# EAGLE design MG (EAGLE 9.2.0)

## Sheet 1 of 3
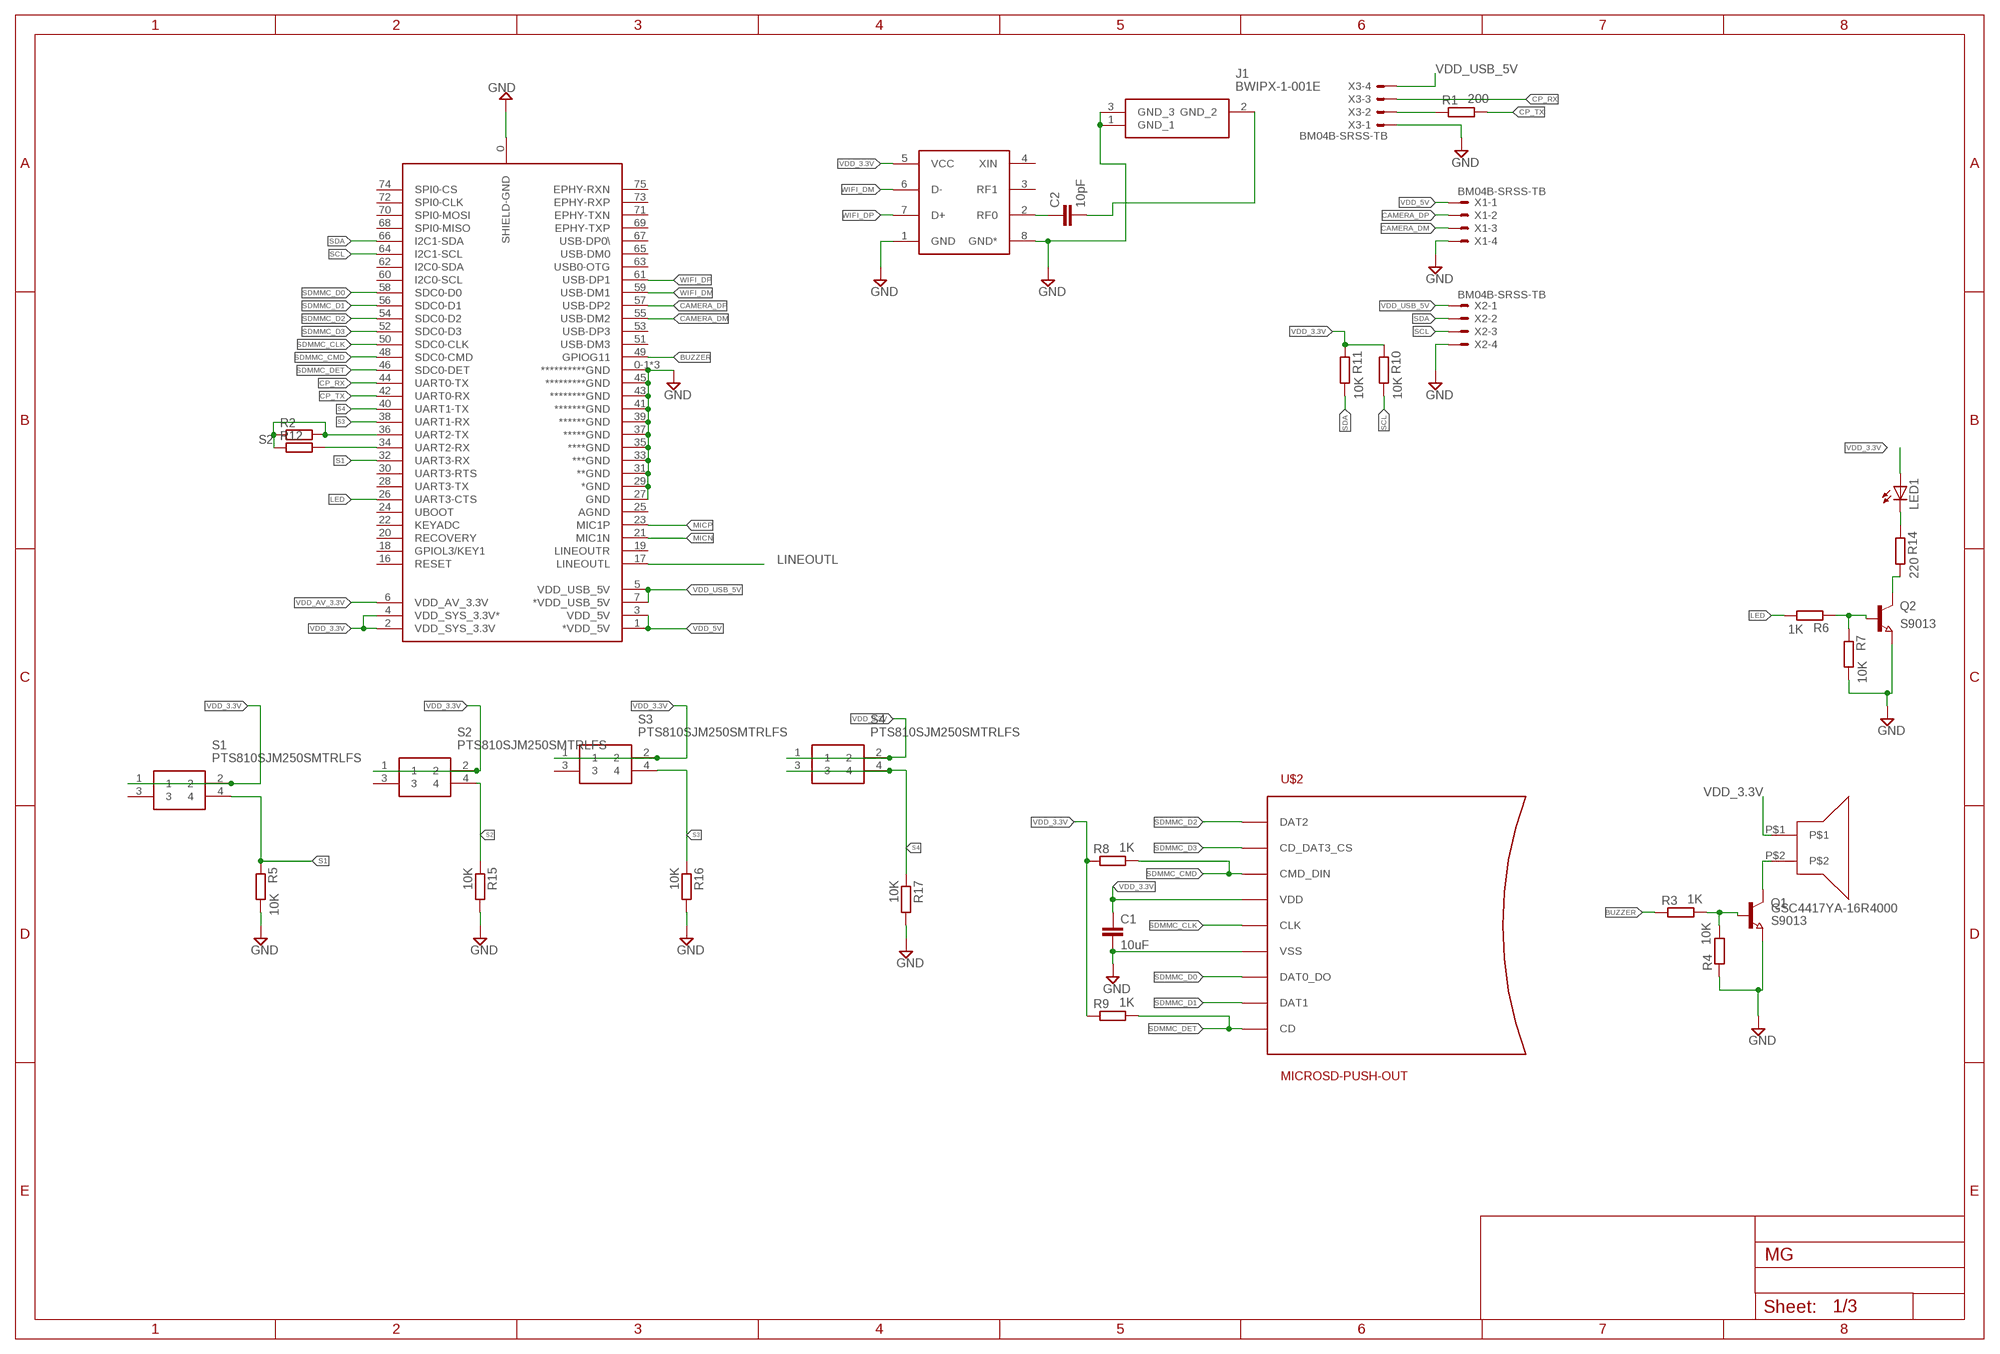
[diagram p0: schematic, sheet 1]

### Parts
C1  10uF  C-EUC0603  [C0603]
C2  10pF  C-EUC0603  [C0603]
J1  BWIPX-1-001E  [BWIPX1001E]
LED1  LEDSML0603  [SML0603]
Q1  S9013  NPN-TRANSISTOR_SOT23  [SOT23]
Q2  S9013  NPN-TRANSISTOR_SOT23  [SOT23]
R1  200  R-EU_R0603  [R0603]
R2  R-EU_R0201  [R0201]
R3  1K  R-EU_R0603  [R0603]
R4  10K  R-EU_R0603  [R0603]
R5  10K  R-EU_R0603  [R0603]
R6  1K  R-EU_R0603  [R0603]
R7  10K  R-EU_R0603  [R0603]
R8  1K  R-EU_R0603  [R0603]
R9  1K  R-EU_R0603  [R0603]
R10  10K  R-EU_R0603  [R0603]
R11  10K  R-EU_R0603  [R0603]
R12  R-EU_R0201  [R0201]
R14  220  R-EU_R0603  [R0603]
R15  10K  R-EU_R0603  [R0603]
R16  10K  R-EU_R0603  [R0603]
R17  10K  R-EU_R0603  [R0603]
S1  PTS810SJM250SMTRLFS  [PTS810SJG250SMTRLFS]
S2  PTS810SJM250SMTRLFS  [PTS810SJG250SMTRLFS]
S3  PTS810SJM250SMTRLFS  [PTS810SJG250SMTRLFS]
S4  PTS810SJM250SMTRLFS  [PTS810SJG250SMTRLFS]
U$1  QUANTUM-CORE  [QUANTUM-QUARK-N]
U$2  MICROSD-PUSH-OUT  [MICROSD-PUSH-OUT]
U$3  WIFI-BT-RTL8723BU  [USB-WIFI-BT-RTL8723BU]
U$4  GSC4417YA-16R4000  [GSC4417YA-16R4000]
X1  BM04B-SRSS-TB  [BM04B-SRSS-TB]
X2  BM04B-SRSS-TB  [BM04B-SRSS-TB]
X3  BM04B-SRSS-TB  [BM04B-SRSS-TB]

### Nets
BUZZER: R3.1 U$1.49(GPIOG11)
CAMERA_DM: U$1.55(USB-DM2) X1.3
CAMERA_DP: U$1.57(USB-DP2) X1.2
CP_RX: U$1.44(UART0-TX) X3.3
CP_TX: R1.2 U$1.42(UART0-RX)
GND: C1.2 J1.1(GND_1) J1.3(GND_3) Q1.2(E) Q2.2(E) R4.1 R5.2 R7.2 R15.2 R16.2 R17.2 U$1.0(SHIELD-GND) U$1.0-1(**********GND) U$1.0-2(**********GND) U$1.27(GND) U$1.29(*GND) U$1.31(**GND) U$1.33(***GND) U$1.35(****GND) U$1.37(*****GND) U$1.39(******GND) U$1.41(*******GND) U$1.43(********GND) U$1.45(*********GND) U$1.47(**********GND) U$2.6(VSS) U$2.G1(VSS) U$2.G2(VSS) U$2.G3(VSS) U$2.G4(VSS) U$3.1(GND) U$3.8(GND*) X1.4 X2.4 X3.1 ; also sheet 2
LED: R6.2 U$1.26(UART3-CTS)
LINEOUTL: U$1.17(LINEOUTL) ; also sheet 2
MICN: U$1.21(MIC1N)
MICP: U$1.23(MIC1P)
N$1: R1.1 X3.2
N$3: Q1.3(C) U$4.P$2
N$4: Q1.1(B) R3.2 R4.2
N$6: R12.2 U$1.34(UART2-RX)
N$9: C2.2 J1.2(GND_2)
N$10: Q2.3(C) R14.2
N$11: C2.1 U$3.2(RF0)
N$13: LED1.C R14.1
N$15: Q2.1(B) R6.1 R7.1
S1: R5.1 S1.4 U$1.32(UART3-RX)
S2: R2.1 R2.2 R12.1 R15.1 S2.4 U$1.36(UART2-TX)
S3: R16.1 S3.4 U$1.38(UART1-RX)
S4: R17.1 S4.3 S4.4 U$1.40(UART1-TX)
SCL: R10.2 U$1.64(I2C1-SCL) X2.3
SDA: R11.2 U$1.66(I2C1-SDA) X2.2
SDMMC_CLK: U$1.50(SDC0-CLK) U$2.5(CLK)
SDMMC_CMD: R8.2 U$1.48(SDC0-CMD) U$2.3(CMD_DIN)
SDMMC_D0: U$1.58(SDC0-D0) U$2.7(DAT0_DO)
SDMMC_D1: U$1.56(SDC0-D1) U$2.8(DAT1)
SDMMC_D2: U$1.54(SDC0-D2) U$2.1(DAT2)
SDMMC_D3: U$1.52(SDC0-D3) U$2.2(CD_DAT3_CS)
SDMMC_DET: R9.2 U$1.46(SDC0-DET) U$2.CD
VDD_3.3V: C1.1 LED1.A R8.1 R9.1 R10.1 R11.1 S1.1 S1.2 S2.1 S2.2 S3.1 S3.2 S4.1 S4.2 U$1.2(VDD_SYS_3.3V) U$1.4(VDD_SYS_3.3V*) U$2.4(VDD) U$3.5(VCC) U$4.P$1
VDD_5V: U$1.1(*VDD_5V) U$1.3(VDD_5V) X1.1 ; also sheet 2
VDD_AV_3.3V: U$1.6(VDD_AV_3.3V)
VDD_USB_5V: U$1.5(VDD_USB_5V) U$1.7(*VDD_USB_5V) X2.1 X3.4
WIFI_DM: U$1.59(USB-DM1) U$3.6(D-)
WIFI_DP: U$1.61(USB-DP1) U$3.7(D+)
Unconnected: S1.3 S2.3 S3.3 U$1.16(RESET) U$1.18(GPIOL3/KEY1) U$1.19(LINEOUTR) U$1.20(RECOVERY) U$1.22(KEYADC) U$1.24(UBOOT) U$1.25(AGND) U$1.28(UART3-TX) U$1.30(UART3-RTS) U$1.51(USB-DM3) U$1.53(USB-DP3) U$1.60(I2C0-SCL) U$1.62(I2C0-SDA) U$1.63(USB0-OTG) U$1.65(USB-DM0) U$1.67(USB-DP0\) U$1.68(SPI0-MISO) U$1.69(EPHY-TXP) U$1.70(SPI0-MOSI) U$1.71(EPHY-TXN) U$1.72(SPI0-CLK) U$1.73(EPHY-RXP) U$1.74(SPI0-CS) U$1.75(EPHY-RXN) U$3.3(RF1) U$3.4(XIN)

## Sheet 2 of 3
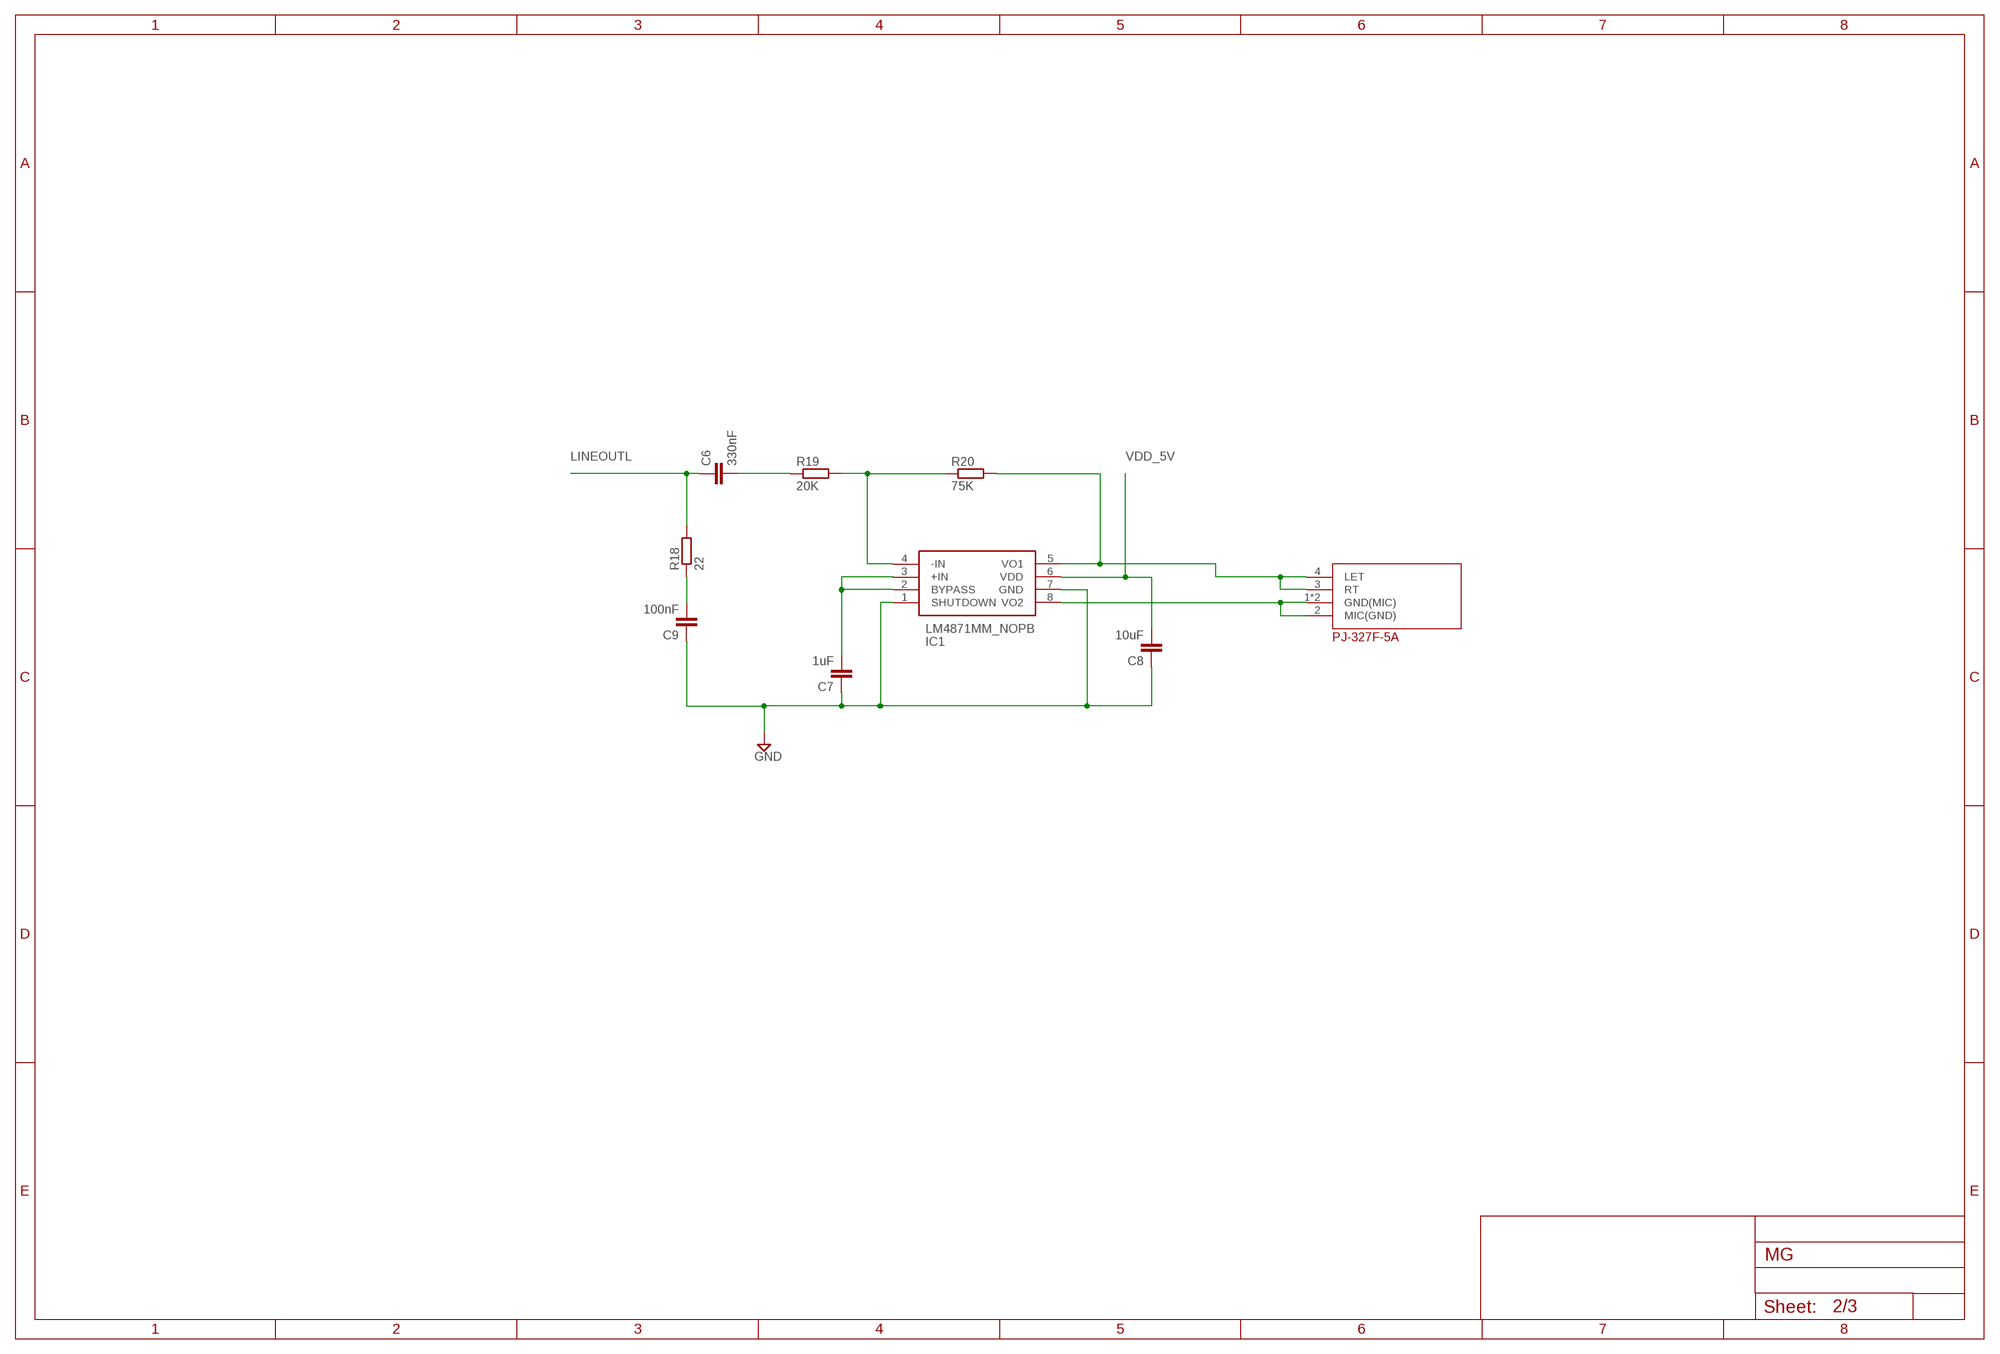
[diagram p1: schematic, sheet 2]

### Parts
C6  330nF  C-EUC0603  [C0603]
C7  1uF  C-EUC0603  [C0603]
C8  10uF  C-EUC0603  [C0603]
C9  100nF  C-EUC0603  [C0603]
IC1  LM4871MM_NOPB  [SOP65P490X110-8N]
R18  22  R-EU_R0603  [R0603]
R19  20K  R-EU_R0603  [R0603]
R20  75K  R-EU_R0603  [R0603]
U$7  PJ-327F-5A  [PJ-327F-5A]

### Nets
GND: C7.1 C8.1 C9.1 IC1.1(SHUTDOWN) IC1.7(GND) ; also sheet 1
LINEOUTL: C6.1 R18.2 ; also sheet 1
N$7: IC1.8(VO2) U$7.1(GND(MIC)) U$7.2(MIC(GND)) U$7.5(GND(MIC))
N$14: C7.2 IC1.2(BYPASS) IC1.3(+IN)
N$16: IC1.4(-IN) R19.2 R20.1
N$17: C6.2 R19.1
N$18: C9.2 R18.1
N$21: IC1.5(VO1) R20.2 U$7.3(RT) U$7.4(LET)
VDD_5V: C8.2 IC1.6(VDD) ; also sheet 1

## Sheet 3 of 3
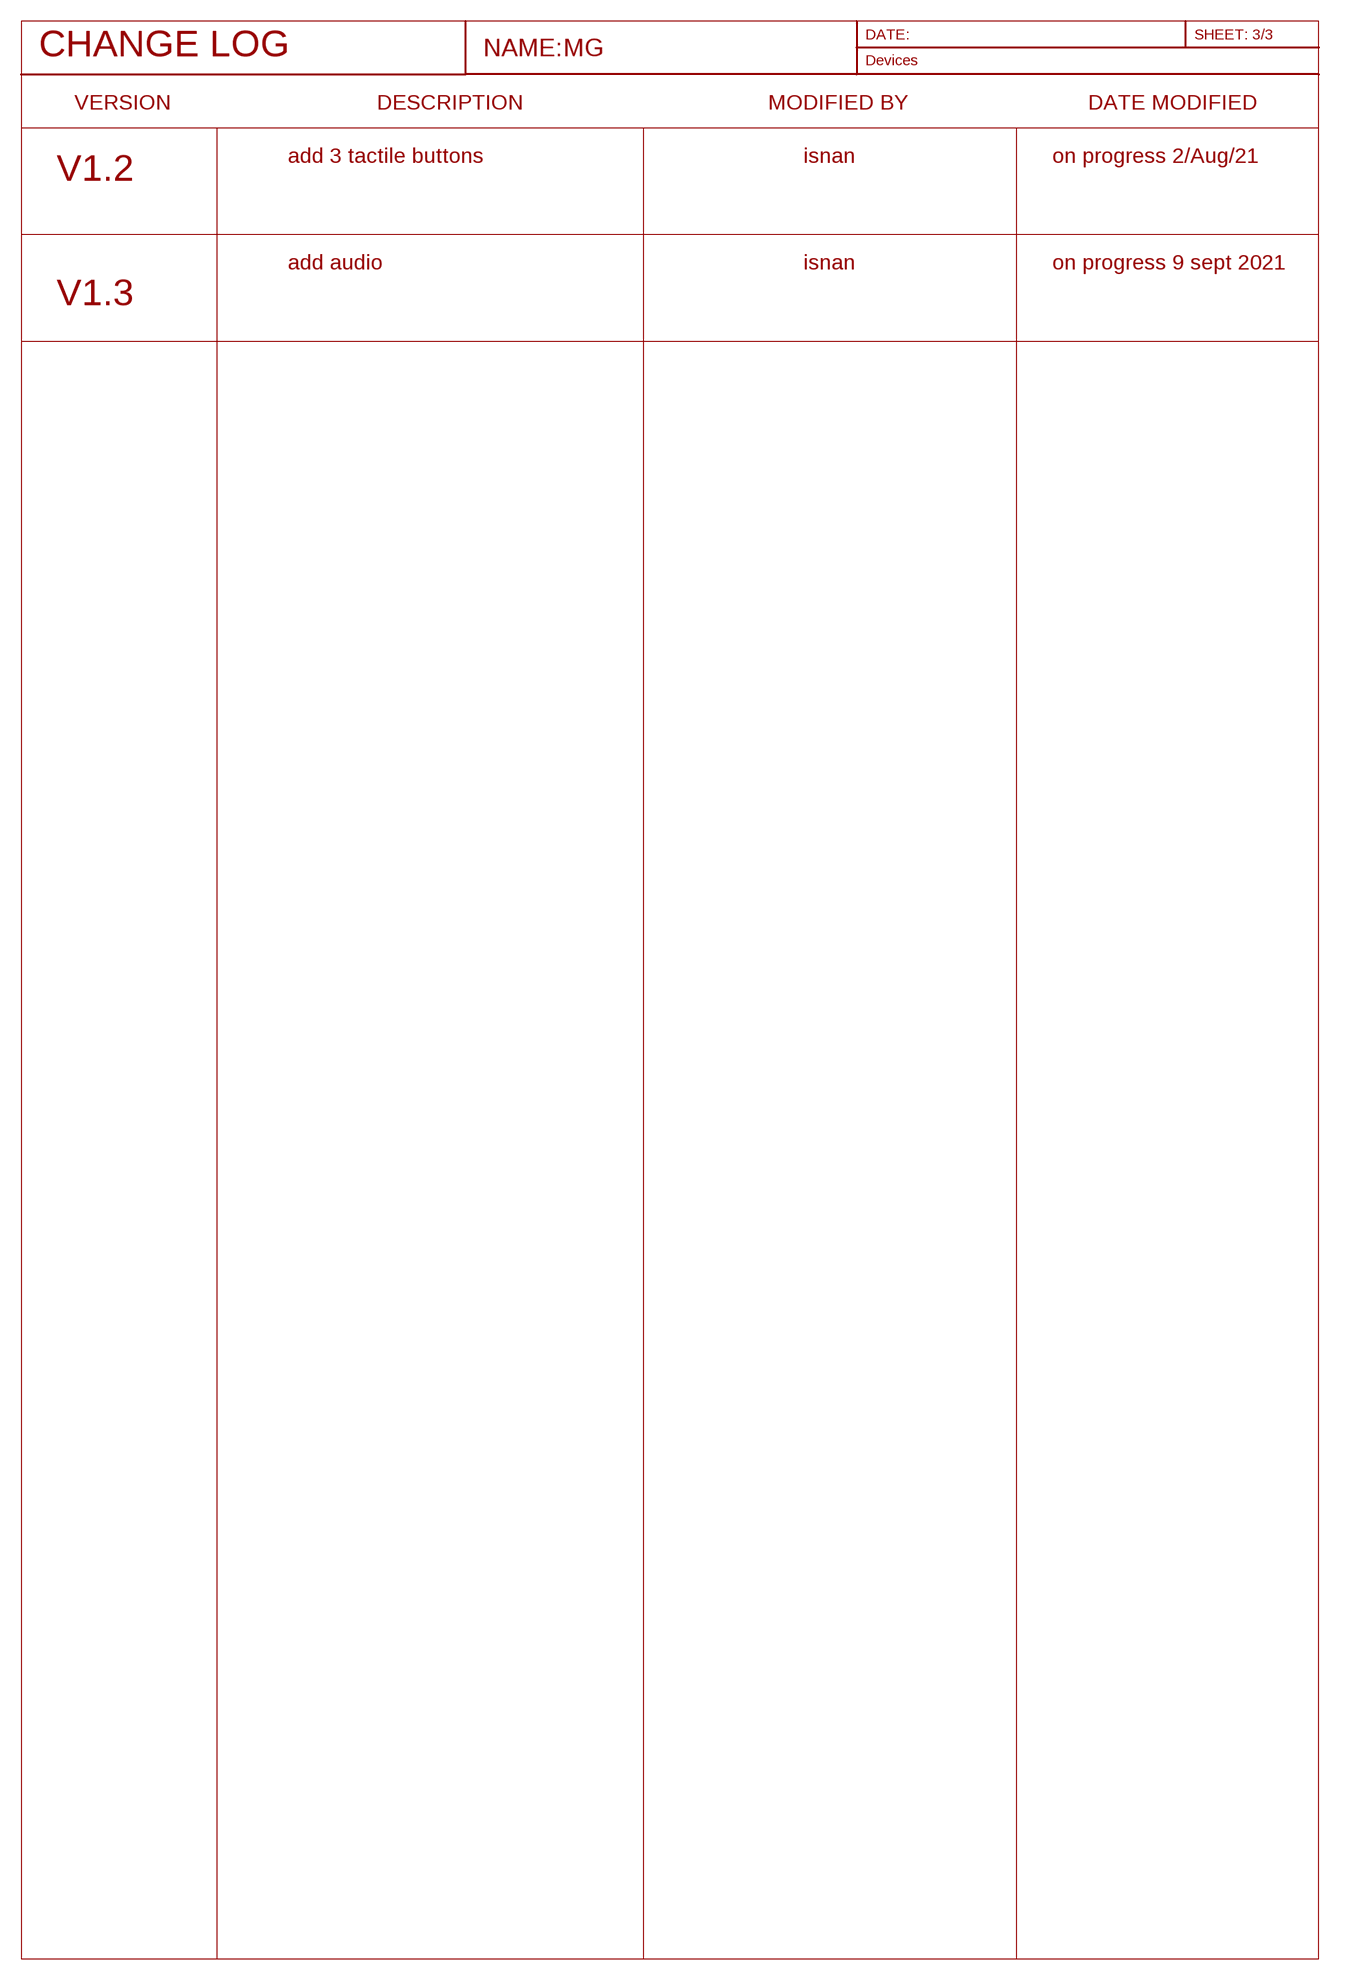
[diagram p2: schematic, sheet 3]

### Notes on the sheet
- CHANGE LOG
- VERSION | DESCRIPTION | MODIFIED BY | DATE MODIFIED
- add 3 tactile buttons | isnan | on progress 2/Aug/21
- V1.2
- add audio | isnan | on progress 9 sept 2021
- V1.3

## Library data of the parts
C1 C2 C6-C9 = rcl:C-EU: CAPACITOR, European symbol; SPICEPREFIX: C
IC1 = SamacSys_Parts:LM4871MM_NOPB: Boomer Series: 3W Audio Amplifier with Shutdown Mode Source: Datasheet <http://www.ti.com/lit/gpn/lm4871>; DESCRIPTION: Boomer Series: 3W Audio Amplifier with Shutdown Mode; HEIGHT: 1.1mm; MANUFACTURER_NAME: Texas Instruments; MANUFACTURER_PART_NUMBER: LM4871MM/NOPB; MOUSER_PART_NUMBER: 926-LM4871MM/NOPB; MOUSER_PRICE-STOCK: https://www.mouser.co.uk/ProductDetail/Texas-Instruments/LM4871MM-NOPB?qs=QbsRYf82W3Hwna5CserDOg%3D%3D
J1 = SamacSys_Parts:BWIPX-1-001E: RF Connectors/Coaxial Connectors RoHS Source: Datasheet <https://datasheet.lcsc.com/szlcsc/2012231509_BAT-WIRELESS-BWIPX-1-001E_C496552.pdf>; DESCRIPTION: RF Connectors/Coaxial Connectors RoHS; HEIGHT: 1.45mm; MANUFACTURER_NAME: BAT WIRELESS; MANUFACTURER_PART_NUMBER: BWIPX-1-001E
LED1 = led:LED: LED OSRAM: - CHIPLED LG R971, LG N971, LY N971, LG Q971, LY Q971, LO R971, LY R971 LH N974, LH R974 LS Q976, LO Q976, LY Q976 LO Q996 - Hyper CHIPLED LW Q18S LB Q993, LB Q99A, LB R99A - SideLED LS A670, LO A670, LY A670, LG A670, LP A670 LB A673, LV A673, LT A673, LW A673 LH A674 LY A675 LS A676, LA A676, LO A676, LY A676, LW A676 LS A679, LY A679, LG A679 - Hyper Micro SIDELED® LS Y876, LA Y876, LO Y876, LY Y876 LT Y87S - SmartLED LW L88C, LW L88S LB L89C, LB L89S, LG L890 LS L89K, LO L89K, LY L89K LS L896, LA L896, LO L896, LY L896 - TOPLED LS T670, LO T670, LY T670, LG T670, LP T670 LSG T670, LSP T670, LSY T670, LOP T670, LYG T670 LG T671, LOG T671, LSG T671 LB T673, LV T673, LT T673, LW T673 LH T674 LS T676, LA T676, LO T676, LY T676, LB T676, LH T676, LSB T676, LW T676 LB T67C, LV T67C, LT T67C, LS T67K, LO T67K, LY T67K, LW E67C LS E67B, LA E67B, LO E67B, LY E67B, LB E67C, LV E67C, LT E67C LW T67C LS T679, LY T679, LG T679 LS T770, LO T770, LY T770, LG T770, LP T770 LB T773, LV T773, LT T773, LW T773 LH T774 LS E675, LA E675, LY E675, LS T675 LS T776, LA T776, LO T776, LY T776, LB T776 LHGB T686 LT T68C, LB T68C - Hyper Mini TOPLED® LB M676 - Mini TOPLED Santana® LG M470 LS M47K, LO M47K, LY M47K Source: http://www.osram.convergy.de LUXEON: - LUMILED® LXK2-PW12-R00, LXK2-PW12-S00, LXK2-PW14-U00, LXK2-PW14-V00 LXK2-PM12-R00, LXK2-PM12-S00, LXK2-PM14-U00 LXK2-PE12-Q00, LXK2-PE12-R00, LXK2-PE12-S00, LXK2-PE14-T00, LXK2-PE14-U00 LXK2-PB12-K00, LXK2-PB12-L00, LXK2-PB12-M00, LXK2-PB14-N00, LXK2-PB14-P00, LXK2-PB14-Q00 LXK2-PR12-L00, LXK2-PR12-M00, LXK2-PR14-Q00, LXK2-PR14-R00 LXK2-PD12-Q00, LXK2-PD12-R00, LXK2-PD12-S00 LXK2-PH12-R00, LXK2-PH12-S00 LXK2-PL12-P00, LXK2-PL12-Q00, LXK2-PL12-R00 Source: www.luxeon.com KINGBRIGHT: KA-3528ASYC Source: www.kingbright.com
Q1 Q2 = semicon-smd-ipc:NPN-TRANSISTOR_: NPN TRANSISTOR
R1-R12 R14-R20 = rcl:R-EU_: RESISTOR, European symbol; SPICEPREFIX: R
S1-S4 = SamacSys_Parts:PTS810SJM250SMTRLFS: PTS810SJM250SMTRLFS (Tactile Switches) Source: Datasheet <https://www.ckswitches.com/media/1476/pts810.pdf>; DESCRIPTION: PTS810SJM250SMTRLFS (Tactile Switches); HEIGHT: mm; MANUFACTURER_NAME: C & K COMPONENTS; MANUFACTURER_PART_NUMBER: PTS810SJM250SMTRLFS; MOUSER_PART_NUMBER: 611-PTS810SJM250SMTR; MOUSER_PRICE-STOCK: https://www.mouser.co.uk/ProductDetail/CK/PTS810SJM250SMTRLFS?qs=UxeAxwACbqnyNdXLIf%2FqnQ%3D%3D
U$1 = Quantum-Core:QUANTUM-CORE
U$2 = microsd:MICROSD-PUSH-OUT: T-Flash Push-Out Micro SD Card Reader 14.75mm x 14.5mm SMD with external pins
U$3 = Wifi_BT_RTL8723BU:WIFI-BT-RTL8723BU
U$4 = GSC4417YA-16R4000:GSC4417YA-16R4000
U$7 = PJ-327F-5A:PJ-327F-5A
X1-X3 = con-jst2:?M04B-SRSS-TB: Disconnectable Crimp style connector, 1.0mm pitch 4 contacts

## Board
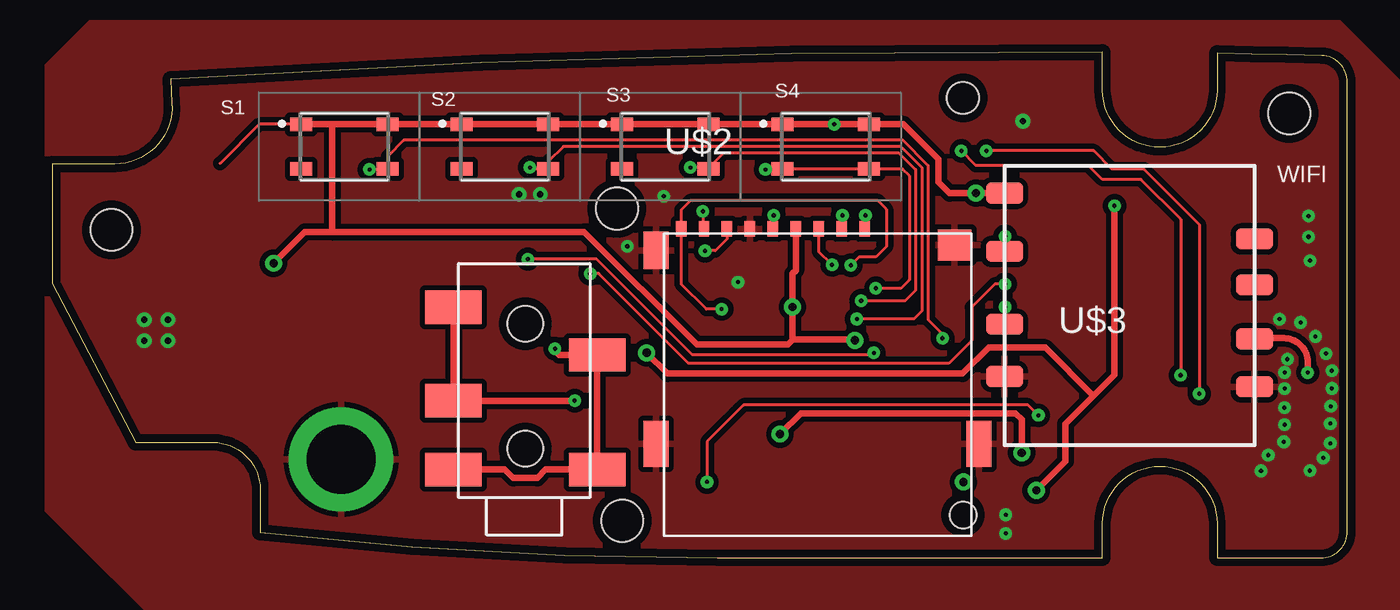
[diagram p3: board, top side]
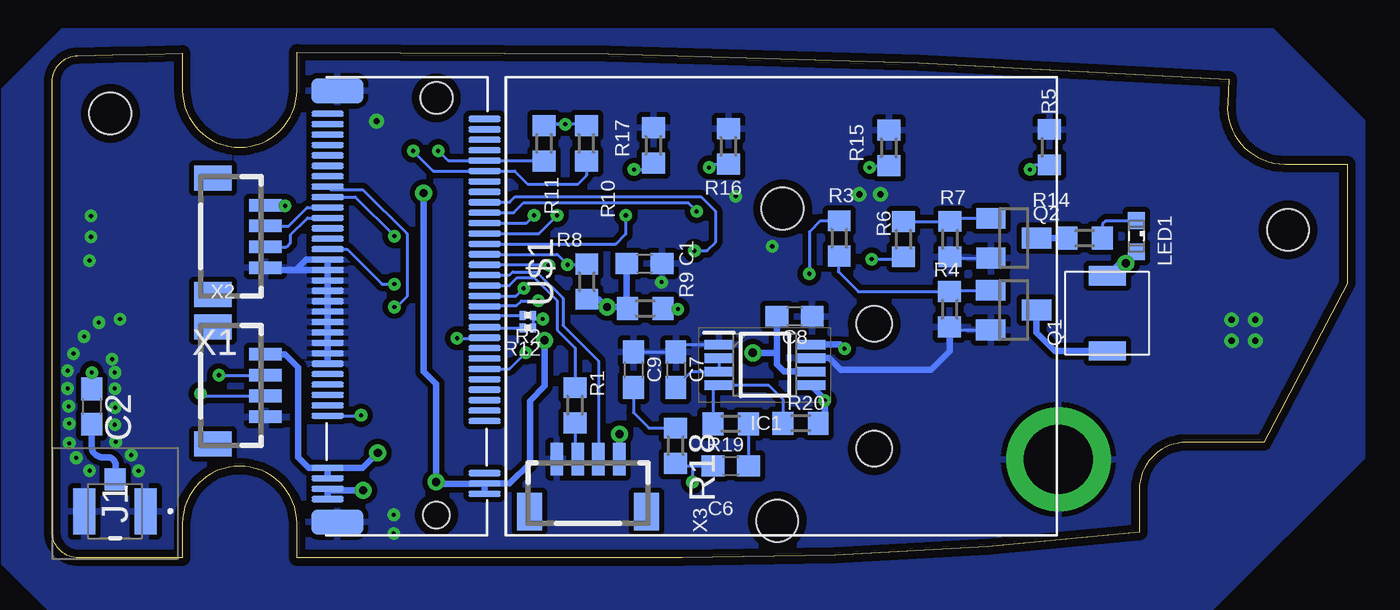
[diagram p4: board, bottom side, seen from below]

Size 62.16 x 24.28 mm. Coordinates in mm from the lower left corner, seen from the top.
Outline: 5.75,21.83 arc-93 3,18.91 0,18.91 0,13.17 4,5.54 7.73,5.54 arc-90 9.98,3.29 9.98,1.22 arc6 31.93,0 50.41,0 50.41,1.65 arc-180 55.91,1.65 55.91,0 60.89,0 arc90 62.16,1.27 62.16,22.84 arc89 60.92,24.11 arc0 55.91,24.22 55.91,22.46 arc-180 50.41,22.46 50.41,24.28 arc4 5.68,22.98 5.75,21.83
Copper layers (1+16): Top 0.035mm / dielectric 1.1mm / Bottom 0.035mm
Design rules "default *": minimum track width 6mil, minimum drill 0.2mm, track to track 5mil, track to pad 5mil, pad to pad 5mil, via to via 5mil, smd to smd 0mil, copper to edge 0.4mm, drill to drill 6mil, minimum pad ring 10mil, minimum via ring 8mil, stop-mask expansion 0.05mm, vias tented up to drill 100mil, thermal gap 10mil
Holes 2 mm at 59.36,21.34 27.36,1.78 27.1,16.77 2.85,15.76

### Footprints (pad centres in the part's own frame; a part is rotated, then mirrored left to right if it is on the bottom)
C0603 = smd 1.1 x 1: 1 -0.85,0; 2 0.85,0
SOP65P490X110-8N = smd 1.4 x 0.45: 1 -2.2,0.975; 2 -2.2,0.325; 3 -2.2,-0.325; 4 -2.2,-0.975; 5 2.2,-0.975; 6 2.2,-0.325; 7 2.2,0.325; 8 2.2,0.975
BWIPX1001E = smd 2.2 x 1.05: 1 0,-1.475; 3 0,1.475 | smd 1.05 x 1: 2 1.525,0
SML0603 = smd 0.8 x 0.8: A 0.75,0; C -0.75,0
SOT23 = smd 1 x 1.4: 1 -0.95,-1.1; 2 0.95,-1.1; 3 0,1.1
R0603 = smd 1 x 1.1: 1 -0.85,0; 2 0.85,0
R0201 = smd 0.28 x 0.43: 1 -0.255,0; 2 0.255,0
PTS810SJG250SMTRLFS = smd 1.05 x 0.65: 1 -2.075,1.075; 2 2.075,1.075; 3 -2.075,-1.075; 4 2.075,-1.075
QUANTUM-QUARK-N = drill 3.3 pad 5: 0 -7.341,-24.232 | smd 1.2 x 2.5: 0-1 -10.35,10.38; 0-2 10.35,10.38 | smd 0.3 x 1.55: 1 -9.25,10.837; 2 -9,3.313; 3 -8.75,10.837; 4 -8.5,3.313; 5 -8.25,10.837; 6 -8,3.313; 7 -7.75,10.837; 16 -5.5,3.313; 17 -5.25,10.837; 18 -5,3.313; 19 -4.75,10.837; 20 -4.5,3.313; 21 -4.25,10.837; 22 -4,3.313; 23 -3.75,10.837; 24 -3.5,3.313; 25 -3.25,10.837; 26 -3,3.313; 27 -2.75,10.837; 28 -2.5,3.313; 29 -2.25,10.837; 30 -2,3.313; 31 -1.75,10.837; 32 -1.5,3.313; 33 -1.25,10.837; 34 -1,3.313; 35 -0.75,10.837; 36 -0.5,3.313; 37 -0.25,10.837; 38 0,3.313; 39 0.25,10.837; 40 0.5,3.313; 41 0.75,10.837; 42 1,3.313; 43 1.25,10.837; 44 1.5,3.313; 45 1.75,10.837; 46 2,3.313; 47 2.25,10.837; 48 2.5,3.313; 49 2.75,10.837; 50 3,3.313; 51 3.25,10.837; 52 3.5,3.313; 53 3.75,10.837; 54 4,3.313; 55 4.25,10.837; 56 4.5,3.313; 57 4.75,10.837; 58 5,3.313; 59 5.25,10.837; 60 5.5,3.313; 61 5.75,10.837; 62 6,3.313; 63 6.25,10.837; 64 6.5,3.313; 65 6.75,10.837; 66 7,3.313; 67 7.25,10.837; 68 7.5,3.313; 69 7.75,10.837; 70 8,3.313; 71 8.25,10.837; 72 8.5,3.313; 73 8.75,10.837; 74 9,3.313; 75 9.25,10.837 | hole 1.524: 10.008,5.613 | hole 1.27: -10.008,5.613
MICROSD-PUSH-OUT = smd 0.5 x 0.75: 1 9.625,0.225; 2 8.525,0.225; 3 7.425,0.225; 4 6.325,0.225; 5 5.225,0.225; 6 4.125,0.225; 7 3.025,0.225; 8 1.925,0.225; CD 0.825,0.225 | smd 1.2 x 1.8: G1 -0.375,-0.8 | smd 1.2 x 2.2: G2 -0.375,-10.1; G4 15.125,-10.1 | smd 1.6 x 1.5: G3 13.95,-0.55
USB-WIFI-BT-RTL8723BU = smd 1.778 x 1.016: 1 -6.112,3.834; 2 -6.112,1.534; 3 -6.112,-1.066; 4 -6.112,-3.266; 5 5.888,-5.466; 6 5.888,-2.666; 7 5.888,0.834; 8 5.888,3.334
GSC4417YA-16R4000 = smd 0.914 x 1.778: P$1 -1.8,0; P$2 1.8,0
PJ-327F-5A = smd 2.7 x 1.6: 1 -3.45,0; 2 -3.45,-5.5; 3 3.45,-3.3; 4 3.45,-7.8; 5 3.45,0 | hole 1.7: 0,-1; 0,-7
BM04B-SRSS-TB = smd 0.6 x 1.55: 1 1.5,-1.625; 2 0.5,-1.625; 3 -0.5,-1.625; 4 -1.5,-1.625 | smd 1.2 x 1.8: FIT@1 2.8,0.9; FIT@2 -2.8,0.9

### Placement (x,y rotation side)
C1  33.73,14.12 0 bottom
C2  60.26,7.27 270 bottom
C6  29.58,4.42 0 bottom
C7  32.23,9.04 270 bottom
C8  26.53,11.6 180 bottom
C9  34.26,9.04 270 bottom
IC1  27.96,9.27 0 bottom
J1  59.13,2.24 90 bottom
LED1  10.13,15.44 270 bottom
Q1  16.02,11.9 270 bottom
Q2  16.01,15.35 270 bottom
R1  37.06,7.32 90 bottom
R2  39.33,11.64 180 bottom
R3  24.39,15.34 270 bottom
R4  19.09,11.93 90 bottom
R5  14.29,19.72 90 bottom
R6  21.31,15.3 270 bottom
R7  19.07,15.31 270 bottom
R8  36.5,13.26 90 bottom
R9  33.7,11.97 0 bottom
R10  36.52,19.9 270 bottom
R11  38.55,19.9 270 bottom
R12  39.33,11.04 180 bottom
R14  12.61,15.35 180 bottom
R15  22.01,19.68 90 bottom
R16  29.71,19.76 90 bottom
R17  33.3,19.81 90 bottom
R18  32.24,5.38 270 bottom
R19  29.58,6.44 180 bottom
R20  26.24,6.47 0 bottom
S1  14.03,19.74 0 top
S2  21.73,19.74 0 top
S3  29.43,19.74 0 top
S4  37.13,19.74 0 top
U$1  38.09,12.07 90 bottom
U$2  29.36,15.57 0 top
U$3  51.59,12.05 180 top
U$4  11.53,11.74 270 bottom
U$7  22.71,4.24 180 top
X1  53.55,15.43 90 bottom
X2  53.54,8.28 90 bottom
X3  36.44,3.12 180 bottom

### Tracks (layer width: path | path; a pad name or v marks a point on that pad's centre or on a via)
BUZZER  (via drill 0.2)
  Top 0.152: v45.73,13.14 45.23,13.14 44.13,12.04 44.13,10.44 43.02,9.34 30.54,9.34 26.22,13.65 25.84,13.65 v25.82,13.64
  Bottom 0.152: U$1.49 48.01,14.82 46.33,13.14 v45.73,13.14 | v25.82,13.64 25.82,15.65 25.29,16.19 R3.1
CAMERA_DM
  Bottom 0.152: U$1.55 49.9,16.32 50.73,15.5 50.73,15.12 50.91,14.93 X1.3
CAMERA_DP
  Bottom 0.152: U$1.57 49.91,16.82 50.8,15.93 X1.2
CP_RX
  Bottom 0.152: U$1.44 40.21,13.57 40.05,13.73 38.9,13.73 37.64,12.47 37.64,11.17 35.94,9.46 X3.3
CP_TX
  Bottom 0.152: U$1.42 40.22,13.07 39.84,13.45 39.02,13.45 37.92,12.35 37.92,10.95 37.06,10.08 R1.2
GND  (via drill 0.2, 0.3)
  Bottom 0.152: IC1.1 31.87,10.24 C7.1 C9.1 | U$1.47 U$1.45 U$1.43 U$1.41 U$1.39 U$1.37 U$1.35 | U$1.33 U$1.27 | Q2.2 19.01,14.4 R7.2 | Q1.2 18.95,10.95 R4.1
  Bottom 0.305: IC1.7 24.88,9.59 24.31,9.02 19.99,9.02 19.08,9.93 R4.1 | X1.4 51.44,13.93 51.33,13.82 50.47,13.82 | 50.47,13.82 U$1.45 | U$1.27 U$1.47 49.97,14.32 50.47,13.82
  other vias: 61,4.8 59.11,5.57 58.36,4.93 4.42,10.42 60.35,4.19 58.01,4.18 58.9,11.46 61.41,8.13 59.91,11.3 59.28,9.54 27.6,14.96 59.13,7.21 61.33,5.5 59.15,8.13 59.15,8.91 60.29,16.41 60.36,14.27 45.76,1.18 29.35,17.36 32.92,13.24 60.29,15.42 60.62,10.63 61.13,9.81 61.41,8.98 61.33,6.45 61.36,7.28 59.15,6.39 45.76,2.06 46.59,20.96 22.4,17.46 5.56,10.42 23.42,17.46 5.56,11.44 4.42,11.44
  pour Top (isolate 0.254, rank 6): 1.83,25.66 -0.2,23.63 -0.2,2.29 6.15,-4.06 63.3,-4.06 64.82,-2.53 64.82,22.61 61.77,25.66
  pour Bottom (isolate 0.254, rank 6): 3.61,25.28 -0.71,20.96 -0.71,4.83 6.78,-2.66 62.03,-2.66 64.44,-0.25 64.44,22.49 61.65,25.28
LED  (via drill 0.2)
  Top 0.152: v22.83,14.34 26.13,14.34 30.73,9.74 39.33,9.74 v39.43,9.84
  Bottom 0.152: R6.2 21.42,14.34 v22.83,14.34 | U$1.26 40.21,9.07 v39.43,9.85 v39.43,9.84
LINEOUTL  (via drill 0.2)
  Top 0.152: v31.43,3.64 31.43,5.58 33.19,7.34 46.83,7.34 v47.33,6.84
  Bottom 0.152: 31.43,4.42 C6.1 | 31.43,4.42 32.12,4.42 R18.2 | 31.43,4.42 v31.43,3.64 | v47.33,6.84 47.35,6.82 U$1.17
N$1
  Bottom 0.152: R1.1 37.06,4.87 X3.2
N$3
  Bottom 0.305: U$4.P$2 14.03,9.94 14.92,10.83 Q1.3
N$4
  Bottom 0.152: Q1.1 19.02,12.85 R4.2 23.47,12.78 24.43,13.74 24.43,14.44 R3.2
N$6
  Bottom 0.152: U$1.34 41.38,11.04 R12.2
N$7  (via drill 0.2)
  Top 0.305: U$7.5 21.72,4.24 22.12,3.84 23.29,3.84 23.69,4.24 U$7.1 U$7.2 24.33,9.74 24.13,9.94 v24.13,10.04
  Bottom 0.305: v24.13,10.04 24.33,10.24 IC1.8
N$9
  Bottom 0.305: J1.2 arc-90 59.11,3.79 59.11,4.45 arc-90 59.49,4.83 59.74,4.83 arc90 60.26,5.35 C2.2
N$10
  Bottom 0.305: R14.2 Q2.3
N$11  (via drill 0.2)
  Top 0.305: v60.25,8.9 60.25,9.41 arc90 59.11,10.55 57.74,10.55 arc90 U$3.2
  Bottom 0.305: C2.1 arc-90 C2.1 v60.25,8.9
N$13
  Bottom 0.152: LED1.C 11.58,16.19 11.76,16.02 R14.1
N$14
  Bottom 0.152: IC1.2 IC1.3 31.47,8.94 C7.2
N$15
  Bottom 0.152: Q2.1 18.92,16.3 R7.1 R6.1
N$16
  Bottom 0.152: R19.2 30.43,8.01 IC1.4 27.78,8.29 27.09,7.61 R20.1
N$17
  Bottom 0.152: R19.1 C6.2
N$18
  Bottom 0.152: R18.1 33.52,6.23 34.26,6.97 C9.2
N$21  (via drill 0.2)
  Top 0.305: U$7.4 U$7.3 v25.07,7.54 v25.08,7.54
  Bottom 0.305: R20.2 25.08,6.78 v25.08,7.54 25.08,7.61 IC1.5
S1  (via drill 0.2)
  Top 0.152: v42.73,10.54 42.73,10.74 42.03,11.44 42.03,18.84 40.83,20.04 16.88,20.04 16.1,19.27 S1.4 16.08,18.64 v15.23,18.64
  Bottom 0.152: v42.73,10.54 41.44,10.54 U$1.32 | R5.1 15,18.87 v15.23,18.64
S2  (via drill 0.2)
  Top 0.152: v38.61,11.47 41.36,11.47 41.75,11.87 41.75,18.73 40.73,19.75 24.53,19.75 23.8,19.02 S2.4 22.93,18.67 v22.93,18.74
  Bottom 0.152: 39.07,11.47 R12.1 | 39.07,11.47 R2.1 R2.2 41.34,11.64 U$1.36 | 39.07,11.47 v38.61,11.47 | R15.1 22.84,18.83 v22.93,18.74
S3  (via drill 0.2)
  Top 0.152: S3.4 31.5,18.74 v30.63,18.74 31.53,18.74 32.23,19.44 40.63,19.44 41.43,18.64 41.43,12.84 40.93,12.34 v38.83,12.34
  Bottom 0.152: v38.83,12.34 39.64,12.34 39.86,12.12 41.36,12.12 U$1.38 | R16.1 30.47,18.91 v30.63,18.74
S4  (via drill 0.2)
  Top 0.152: v39.53,12.94 40.73,12.94 41.13,13.34 41.13,18.34 40.8,18.67 S4.4 35.13,18.67 34.25,18.67 v34.23,18.64
  Top 0.305: 35.13,18.67 S4.3
  Bottom 0.152: U$1.40 39.9,12.57 v39.53,12.94 | R17.1 33.61,18.64 v34.23,18.64
SCL  (via drill 0.2)
  Top 0.152: v55.04,7.88 55.04,16.01 52.38,18.68 50.85,18.68 49.98,19.54 v44.83,19.54
  Bottom 0.152: v44.83,19.54 44.84,19.54 43.87,18.57 U$1.64 39.96,18.57 39.33,17.94 36.93,17.94 36.52,18.35 R10.2 | v55.04,7.88 54.94,7.78 X2.3
SDA  (via drill 0.2)
  Top 0.152: v43.63,19.54 44.33,18.84 49.73,18.84 50.4,18.17 52.25,18.17 54.15,16.26 v54.15,8.77
  Bottom 0.152: v43.63,19.54 43.16,19.07 U$1.66 38.57,19.07 R11.2 | v54.15,8.77 X2.2
SDMMC_CLK  (via drill 0.2)
  Top 0.152: v34.63,16.44 34.58,16.4 U$2.5
  Bottom 0.152: U$1.50 35.1,15.07 34.63,15.54 v34.63,16.44
SDMMC_CMD  (via drill 0.2)
  Top 0.152: U$2.3 36.78,14.72 v37.43,14.07
  Bottom 0.152: U$1.48 37.91,14.57 37.43,14.09 v37.43,14.07 36.54,14.07 R8.2
SDMMC_D0  (via drill 0.2)
  Top 0.152: v31.33,14.74 31.83,14.74 32.38,15.3 U$2.7
  Bottom 0.152: U$1.58 40.2,17.07 39.93,17.34 31.03,17.34 30.33,16.64 30.33,15.14 30.73,14.74 v31.33,14.74
SDMMC_D1  (via drill 0.2)
  Top 0.152: v31.23,16.64 31.23,15.85 U$2.8
  Bottom 0.152: U$1.56 40,16.57 39.52,17.05 31.63,17.05 v31.23,16.64
SDMMC_D2  (via drill 0.2)
  Top 0.152: U$2.1 39.03,15.84 v39.03,16.44
  Bottom 0.152: v39.03,16.44 39.4,16.07 U$1.54
SDMMC_D3  (via drill 0.2)
  Top 0.152: U$2.2 37.93,15.84 v37.93,16.44
  Bottom 0.152: v37.93,16.44 38.8,15.57 U$1.52
SDMMC_DET  (via drill 0.2)
  Top 0.152: v38.33,14.04 38.73,14.44 39.53,14.44 40.03,14.94 40.03,16.74 39.63,17.14 30.63,17.14 30.18,16.7 U$2.CD 30.18,13.15 31.39,11.94 v32.13,11.94
  Bottom 0.152: U$1.46 38.36,14.07 v38.33,14.04 | v32.13,11.94 32.82,11.94 R9.2
VDD_3.3V  (via drill 0.2, 0.4)
  Top 0.152: S1.1 9.94,20.82 8.05,18.93
  Top 0.305: v38.53,10.44 38.48,10.49 35.53,10.49 v35.53,12.04 35.53,13.64 35.68,13.8 U$2.4 | v10.63,14.14 12.13,15.64 13.43,15.64 | 13.43,15.64 25.53,15.64 30.94,10.24 35.3,10.24 35.56,10.49 | 13.43,20.82 S1.1 | 13.43,20.82 S1.2 S2.1 S2.2 S3.1 S3.2 S4.1 v37.53,20.82 S4.2 40.85,20.82 42.53,19.14 42.53,18.04 43.06,17.51 v44.33,17.51 U$3.5 | 13.43,20.82 13.43,15.64
  Bottom 0.152: R10.1 36.62,20.85 38.45,20.85 R11.1 38.48,20.82 v37.53,20.82
  Bottom 0.305: v38.53,10.44 38.53,8.24 39.23,7.54 39.23,4.54 40.2,3.57 U$1.4 U$1.2 41.41,3.54 43.63,3.54 v43.73,3.64 43.73,8.34 44.33,8.94 v44.33,17.51 | LED1.A 10.13,14.64 v10.63,14.14 10.93,14.14 U$4.P$1 | 34.62,12.04 v35.53,12.04 35.9,12.41 R8.1 | 34.62,12.04 R9.1 | C1.1 34.58,12.09 34.62,12.04
VDD_5V  (via drill 0.2, 0.4)
  Top 0.305: v28.53,9.84 29.53,8.84 43.69,8.84 44.94,10.1 47.65,10.1 49.97,7.79 | v47.23,3.24 48.63,4.64 48.63,6.44 49.97,7.79 | 49.97,7.79 50.98,8.79 v50.98,16.9
  Bottom 0.305: U$1.1 U$1.3 48.85,3.24 v47.23,3.24 | C8.2 27.38,9.84 | 27.38,9.84 27.38,9.3 27.03,8.94 IC1.6 | v28.53,9.84 27.38,9.84 | X1.1 51.88,16.9 v50.98,16.9
VDD_USB_5V  (via drill 0.4)
  Top 0.305: v46.53,5.04 46.53,6.64 46.23,6.94 35.93,6.94 v34.93,5.94
  Bottom 0.305: U$1.7 47.25,4.32 v46.53,5.04 | v34.93,5.94 34.94,5.93 X3.4 | U$1.7 U$1.5 | X2.1 50.97,9.78 50.34,9.15 50.34,4.83 49.83,4.32 U$1.7
WIFI_DM  (via drill 0.2)
  Top 0.152: U$3.6 45.73,14.74 v45.73,15.44
  Bottom 0.152: v45.73,15.44 47.61,17.32 U$1.59
WIFI_DP  (via drill 0.2)
  Top 0.152: v45.73,12.04 45.73,11.24 U$3.7
  Bottom 0.152: U$1.61 48.78,17.68 47.24,17.68 45.13,15.56 45.13,12.54 45.63,12.04 v45.73,12.04

### Text on the board
tPlace: WIFI